# Altium project IF_filter.PrjPcb
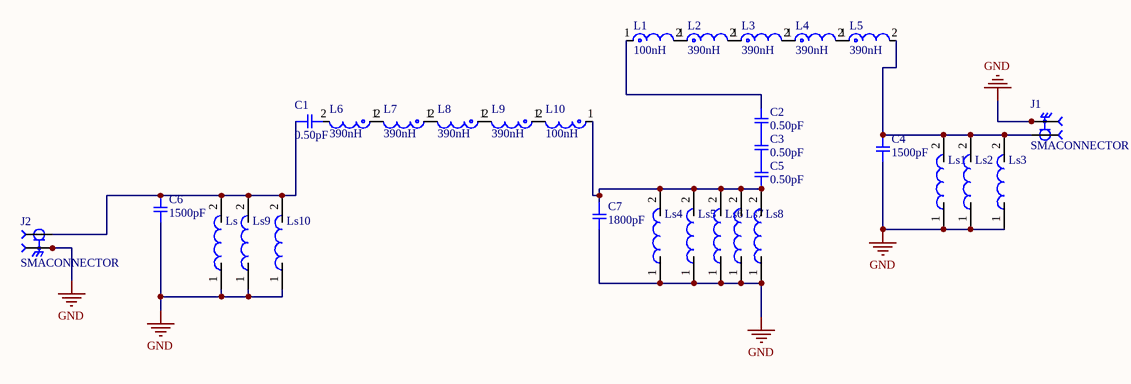
[diagram p0: Schematic_IF_filter.SchDoc]
1 sheet, 30 parts. Net scope: global (net labels, ports and power ports of the same name join across sheets).
Board file: IF_pcb.PcbDoc

## Sheet Schematic_IF_filter.SchDoc
size A4; SheetNumber: 1; SheetTotal: 1

### Parts
C1  0.50pF  [SMD-0402C]
C2  0.50pF  [SMD-0402C]
C3  0.50pF  [SMD-0402C]
C4  1500pF  [SMD-0603C]
C5  0.50pF  [SMD-0402C]
C6  1500pF  [SMD-0603C]
C7  1800pF  [SMD-0603C]
J1  SMACONNECTOR  [LPRS_SMACONNECTOR]
J2  SMACONNECTOR  [LPRS_SMACONNECTOR]
L1  100nH  [FP-LQG18HH_00-MFG]
L2  390nH  [FP-LQG18HH_00-MFG]
L3  390nH  [FP-LQG18HH_00-MFG]
L4  390nH  [FP-LQG18HH_00-MFG]
L5  390nH  [FP-LQG18HH_00-MFG]
L6  390nH  [FP-LQG18HH_00-MFG]
L7  390nH  [FP-LQG18HH_00-MFG]
L8  390nH  [FP-LQG18HH_00-MFG]
L9  390nH  [FP-LQG18HH_00-MFG]
L10  100nH  [FP-LQG18HH_00-MFG]
Ls  0302cs_Coil  [0302CS SERIES]  (value not drawn)
Ls1  0302cs_Coil  [0302CS SERIES]  (value not drawn)
Ls2  0302cs_Coil  [0302CS SERIES]  (value not drawn)
Ls3  0302cs_Coil  [0302CS SERIES]  (value not drawn)
Ls4  0302cs_Coil  [0302CS SERIES]  (value not drawn)
Ls5  0302cs_Coil  [0302CS SERIES]  (value not drawn)
Ls6  0302cs_Coil  [0302CS SERIES]  (value not drawn)
Ls7  0302cs_Coil  [0302CS SERIES]  (value not drawn)
Ls8  0302cs_Coil  [0302CS SERIES]  (value not drawn)
Ls9  0302cs_Coil  [0302CS SERIES]  (value not drawn)
Ls10  0302cs_Coil  [0302CS SERIES]  (value not drawn)

### Nets
GND: C4.2 C6.2 C7.2 J1.2 J1.3 J1.4 J1.5 J2.2 J2.3 J2.4 J2.5 Ls.1 Ls1.1 Ls2.1 Ls3.1 Ls4.1 Ls5.1 Ls6.1 Ls7.1 Ls8.1 Ls9.1 Ls10.1
NetC1_1: C1.1 C6.1 J2.1 Ls.2 Ls9.2 Ls10.2
NetC1_2: C1.2 L6.2
NetC2_1: C2.1 C3.2
NetC2_2: C2.2 L1.1
NetC3_1: C3.1 C5.2
NetC4_1: C4.1 J1.1 L5.2 Ls1.2 Ls2.2 Ls3.2
NetC5_1: C5.1 C7.1 L10.1 Ls4.2 Ls5.2 Ls6.2 Ls7.2 Ls8.2
NetL1_2: L1.2 L2.1
NetL2_2: L2.2 L3.1
NetL3_2: L3.2 L4.1
NetL4_2: L4.2 L5.1
NetL6_1: L6.1 L7.2
NetL7_1: L7.1 L8.2
NetL8_1: L8.1 L9.2
NetL9_1: L9.1 L10.2

### Library data of the parts
C1-C3 C5 = GRM1555C2AR50BA01D: CAP CER 0.5PF 100V NP0 0402; Manufacturer: Murata Electronics North America; Factory Stock: 0; Unit Price (USD): 0.1; Minimum Quantity: 1; Tolerance: ±0.1pF; Temperature Coefficient: C0G, NP0; Datasheets: http://www.murata.com/~/media/webrenewal/support/library/catalog/products/capacitor/mlcc/c02e.pdf; Image: //media.digikey.com/Renders/Murata%20Renders/ZRB-SERIES-0402.jpg; Digi-Key Part Number: 490-7274-1-ND; Part Number: GRM1555C2AR50BA01D; Quantity Available: 19378; @ qty: 0; Packaging: Cut Tape (CT); Series: GRM; Part Status: Active; Value: 0.50pF; Voltage: 100V; Operating Temperature: -55°C ~ 125°C; Features: -; Ratings: -; Applications: General Purpose; Mounting Type: Surface Mount, MLCC; Package / Case: 0402 (1005 Metric); Size / Dimension: 0.039" L x 0.020" W (1.00mm x 0.50mm); Height - Seated (Max): -; Thickness (Max): 0.022" (0.55mm); Lead Spacing: -; Lead Style: -
C4 C6 = GCM1885C1H152JA16D: CAP CER 1500PF 50V NP0 0603; Manufacturer: Murata Electronics North America; Factory Stock: 0; Unit Price (USD): 0.11; Minimum Quantity: 1; Tolerance: ±5%; Temperature Coefficient: C0G, NP0; Datasheets: http://www.murata.com/~/media/webrenewal/support/library/catalog/products/capacitor/mlcc/c03e.ashx; Image: //media.digikey.com/Renders/Murata%20Renders/0603%28GCM188%29.jpg; Digi-Key Part Number: 490-4967-1-ND; Part Number: GCM1885C1H152JA16D; Quantity Available: 20145; @ qty: 0; Packaging: Cut Tape (CT); Series: GCM; Part Status: Active; Value: 1500pF; Voltage: 50V; Operating Temperature: -55°C ~ 125°C; Features: -; Ratings: AEC-Q200; Applications: Automotive; Mounting Type: Surface Mount, MLCC; Package / Case: 0603 (1608 Metric); Size / Dimension: 0.063" L x 0.031" W (1.60mm x 0.80mm); Height - Seated (Max): -; Thickness (Max): 0.035" (0.90mm); Lead Spacing: -; Lead Style: -
C7 = GCM1885C1H182JA16D: CAP CER 1800PF 50V NP0 0603; Manufacturer: Murata Electronics North America; Factory Stock: 0; Unit Price (USD): 0.16; Minimum Quantity: 1; Tolerance: ±5%; Temperature Coefficient: C0G, NP0; Datasheets: http://www.murata.com/~/media/webrenewal/support/library/catalog/products/capacitor/mlcc/c03e.ashx; Image: //media.digikey.com/Renders/Murata%20Renders/0603%28GCM188%29.jpg; Digi-Key Part Number: 490-8004-1-ND; Part Number: GCM1885C1H182JA16D; Quantity Available: 13070; @ qty: 0; Packaging: Cut Tape (CT); Series: GCM; Part Status: Active; Value: 1800pF; Voltage: 50V; Operating Temperature: -55°C ~ 125°C; Features: -; Ratings: AEC-Q200; Applications: Automotive; Mounting Type: Surface Mount, MLCC; Package / Case: 0603 (1608 Metric); Size / Dimension: 0.063" L x 0.031" W (1.60mm x 0.80mm); Height - Seated (Max): -; Thickness (Max): 0.035" (0.90mm); Lead Spacing: -; Lead Style: -
J1 J2 = SMACONNECTOR: SMA female RF coaxial connector for SMA male RF antennas.; Package: None; Price: None; Value: *; MP: SMACONNECTOR; Availability: Unavailable
L1-L10 = CMP-06042-016493-1: Multilayer type RF Inductor 1.8nH ±0.3nH 0.1Ω 1100mA 0603; Core Material: Air; Test Frequency: 100MHz; Shielding: Unshielded; Max DC Current: 500mA; DC Resistance (DCR): 100mR; Q Factor: 12; Self Resonant Frequency: 6GHz; Height - Seated (Max): 0.037inch; Series: LQG18H; Termination: SMD/SMT; Height: 0.8mm; Length: 1.6mm; Number of Pins: 2; Max Operating Temperature: 85°C; Case Code (Imperial): 0603; Military Standard: Not; Case Code (Metric): 1608; Radiation Hardening: No; REACH SVHC: No SVHC; Package Quantity: 4000; Packaging: Tape and Reel; Mount: Surface Mount; Lead Free: Lead Free; Case/Package: 0603; RoHS Compliant: Yes; Min Operating Temperature: -55°C; DC Current: 500mA; Current Rating: 500mA; Depth: 0.95mm; Rated Current-Max: 500mA; Inductance: 1.8nH; Width: 0.8mm